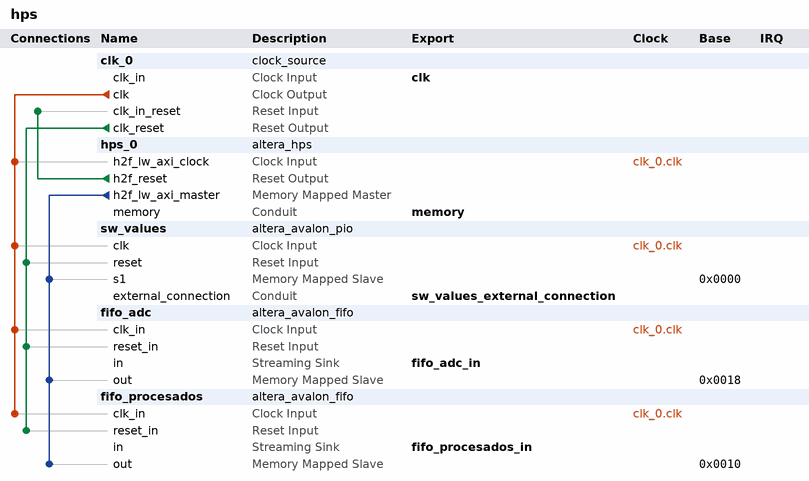
[diagram p0: system contents]
# Platform Designer (Qsys) system hps, Cyclone V 5CSEBA6U23I7
# Parameters at their usual value, and those the tool derives, are not listed.
package require -exact qsys 13.1
create_system hps
set_project_property DEVICE_FAMILY {Cyclone V}
set_project_property DEVICE 5CSEBA6U23I7

add_instance clk_0 clock_source 13.1
set_instance_parameter_value clk_0 clockFrequency 50000000

add_instance hps_0 altera_hps 13.1
set_instance_parameter_value hps_0 MEM_VENDOR JEDEC
set_instance_parameter_value hps_0 MEM_CLK_FREQ_MAX 400.0
set_instance_parameter_value hps_0 MEM_ROW_ADDR_WIDTH 12
set_instance_parameter_value hps_0 MEM_COL_ADDR_WIDTH 8
set_instance_parameter_value hps_0 MEM_DQ_WIDTH 8
set_instance_parameter_value hps_0 MEM_BANKADDR_WIDTH 3
set_instance_parameter_value hps_0 MEM_DRV_STR RZQ/6
set_instance_parameter_value hps_0 MEM_RTT_NOM {ODT Disabled}
set_instance_parameter_value hps_0 MEM_RTT_WR {Dynamic ODT off}
set_instance_parameter_value hps_0 MEM_WTCL 6
set_instance_parameter_value hps_0 MEM_TCL 7
set_instance_parameter_value hps_0 TIMING_TIS 175
set_instance_parameter_value hps_0 TIMING_TIH 250
set_instance_parameter_value hps_0 TIMING_TDS 50
set_instance_parameter_value hps_0 TIMING_TDH 125
set_instance_parameter_value hps_0 TIMING_TDQSQ 120
set_instance_parameter_value hps_0 TIMING_TDQSCK 400
set_instance_parameter_value hps_0 TIMING_TQSH 0.38
set_instance_parameter_value hps_0 MEM_TINIT_US 499
set_instance_parameter_value hps_0 MEM_TMRD_CK 3
set_instance_parameter_value hps_0 MEM_TRAS_NS 40.0
set_instance_parameter_value hps_0 MEM_TRCD_NS 15.0
set_instance_parameter_value hps_0 MEM_TRP_NS 15.0
set_instance_parameter_value hps_0 MEM_TREFI_US 7.0
set_instance_parameter_value hps_0 MEM_TRFC_NS 75.0
set_instance_parameter_value hps_0 MEM_TWTR 2
set_instance_parameter_value hps_0 MEM_TFAW_NS 37.5
set_instance_parameter_value hps_0 REF_CLK_FREQ 125.0
set_instance_parameter_value hps_0 DEFAULT_FAST_SIM_MODEL true
set_instance_parameter_value hps_0 TIMING_BOARD_MAX_CK_DELAY 0.6
set_instance_parameter_value hps_0 TIMING_BOARD_MAX_DQS_DELAY 0.6
set_instance_parameter_value hps_0 TIMING_BOARD_SKEW_CKDQS_DIMM_MIN -0.01
set_instance_parameter_value hps_0 TIMING_BOARD_SKEW_CKDQS_DIMM_MAX 0.01
set_instance_parameter_value hps_0 TIMING_BOARD_SKEW_WITHIN_DQS 0.02
set_instance_parameter_value hps_0 TIMING_BOARD_SKEW_BETWEEN_DQS 0.02
set_instance_parameter_value hps_0 TIMING_BOARD_DQ_TO_DQS_SKEW 0.0
set_instance_parameter_value hps_0 TIMING_BOARD_AC_SKEW 0.02
set_instance_parameter_value hps_0 TIMING_BOARD_AC_TO_CK_SKEW 0.0
set_instance_parameter_value hps_0 MEM_CLK_FREQ 300.0
set_instance_parameter_value hps_0 HPS_PROTOCOL DDR3
set_instance_parameter_value hps_0 STM_Enable false
set_instance_parameter_value hps_0 F2S_Width 0
set_instance_parameter_value hps_0 S2F_Width 0
set_instance_parameter_value hps_0 LWH2F_Enable true
set_instance_parameter_value hps_0 F2SCLK_DBGRST_Enable false
set_instance_parameter_value hps_0 F2SCLK_WARMRST_Enable false
set_instance_parameter_value hps_0 F2SCLK_COLDRST_Enable false
set_instance_parameter_value hps_0 F2SINTERRUPT_Enable false
set_instance_parameter_value hps_0 EMAC1_PinMuxing Unused
set_instance_parameter_value hps_0 EMAC1_Mode N/A
set_instance_parameter_value hps_0 QSPI_PinMuxing Unused
set_instance_parameter_value hps_0 QSPI_Mode N/A
set_instance_parameter_value hps_0 SDIO_PinMuxing Unused
set_instance_parameter_value hps_0 SDIO_Mode N/A
set_instance_parameter_value hps_0 USB1_PinMuxing Unused
set_instance_parameter_value hps_0 USB1_Mode N/A
set_instance_parameter_value hps_0 SPIM1_PinMuxing Unused
set_instance_parameter_value hps_0 SPIM1_Mode N/A
set_instance_parameter_value hps_0 UART0_PinMuxing Unused
set_instance_parameter_value hps_0 UART0_Mode N/A
set_instance_parameter_value hps_0 I2C0_PinMuxing Unused
set_instance_parameter_value hps_0 I2C0_Mode N/A
set_instance_parameter_value hps_0 I2C1_PinMuxing Unused
set_instance_parameter_value hps_0 I2C1_Mode N/A
set_instance_parameter_value hps_0 S2FCLK_USER1CLK_FREQ 100
set_instance_parameter_value hps_0 FPGA_PERIPHERAL_OUTPUT_CLOCK_FREQ_EMAC0_MD_CLK 100
set_instance_parameter_value hps_0 FPGA_PERIPHERAL_OUTPUT_CLOCK_FREQ_EMAC0_GTX_CLK 100
set_instance_parameter_value hps_0 FPGA_PERIPHERAL_OUTPUT_CLOCK_FREQ_EMAC1_MD_CLK 100
set_instance_parameter_value hps_0 FPGA_PERIPHERAL_OUTPUT_CLOCK_FREQ_EMAC1_GTX_CLK 100

add_instance sw_values altera_avalon_pio 13.1
set_instance_parameter_value sw_values direction Input
set_instance_parameter_value sw_values width 8

add_instance fifo_adc altera_avalon_fifo 13.1
set_instance_parameter_value fifo_adc bitsPerSymbol 32
set_instance_parameter_value fifo_adc channelWidth 0
set_instance_parameter_value fifo_adc errorWidth 0
set_instance_parameter_value fifo_adc fifoDepth 128
set_instance_parameter_value fifo_adc fifoInputInterfaceOptions AVALONST_SINK
set_instance_parameter_value fifo_adc fifoOutputInterfaceOptions AVALONMM_READ
set_instance_parameter_value fifo_adc singleClockMode true
set_instance_parameter_value fifo_adc symbolsPerBeat 1
set_instance_parameter_value fifo_adc useBackpressure false
set_instance_parameter_value fifo_adc useIRQ true
set_instance_parameter_value fifo_adc usePacket false
set_instance_parameter_value fifo_adc useReadControl false
set_instance_parameter_value fifo_adc useWriteControl false

add_instance fifo_procesados altera_avalon_fifo 13.1
set_instance_parameter_value fifo_procesados bitsPerSymbol 32
set_instance_parameter_value fifo_procesados channelWidth 0
set_instance_parameter_value fifo_procesados errorWidth 0
set_instance_parameter_value fifo_procesados fifoDepth 128
set_instance_parameter_value fifo_procesados fifoInputInterfaceOptions AVALONST_SINK
set_instance_parameter_value fifo_procesados fifoOutputInterfaceOptions AVALONMM_READ
set_instance_parameter_value fifo_procesados singleClockMode true
set_instance_parameter_value fifo_procesados symbolsPerBeat 1
set_instance_parameter_value fifo_procesados useBackpressure false
set_instance_parameter_value fifo_procesados useIRQ true
set_instance_parameter_value fifo_procesados usePacket false
set_instance_parameter_value fifo_procesados useReadControl false
set_instance_parameter_value fifo_procesados useWriteControl false

# connections
add_connection clk_0.clk fifo_adc.clk_in clock
add_connection clk_0.clk fifo_procesados.clk_in clock
add_connection clk_0.clk hps_0.h2f_lw_axi_clock clock
add_connection clk_0.clk sw_values.clk clock
add_connection clk_0.clk_reset fifo_adc.reset_in reset
add_connection clk_0.clk_reset fifo_procesados.reset_in reset
add_connection clk_0.clk_reset sw_values.reset reset
add_connection hps_0.h2f_reset clk_0.clk_in_reset reset
add_connection hps_0.h2f_lw_axi_master fifo_adc.out avalon
set_connection_parameter_value hps_0.h2f_lw_axi_master/fifo_adc.out baseAddress 0x0018
add_connection hps_0.h2f_lw_axi_master fifo_procesados.out avalon
set_connection_parameter_value hps_0.h2f_lw_axi_master/fifo_procesados.out baseAddress 0x0010
add_connection hps_0.h2f_lw_axi_master sw_values.s1 avalon
set_connection_parameter_value hps_0.h2f_lw_axi_master/sw_values.s1 baseAddress 0x0000

# exported interfaces
add_interface clk clock sink
set_interface_property clk EXPORT_OF clk_0.clk_in
add_interface memory conduit end
set_interface_property memory EXPORT_OF hps_0.memory
add_interface sw_values_external_connection conduit end
set_interface_property sw_values_external_connection EXPORT_OF sw_values.external_connection
add_interface fifo_adc_in avalon_streaming sink
set_interface_property fifo_adc_in EXPORT_OF fifo_adc.in
add_interface fifo_procesados_in avalon_streaming sink
set_interface_property fifo_procesados_in EXPORT_OF fifo_procesados.in

set_interconnect_requirement {$system} qsys_mm.clockCrossingAdapter HANDSHAKE
set_interconnect_requirement {$system} qsys_mm.maxAdditionalLatency 1
set_interconnect_requirement {$system} qsys_mm.insertDefaultSlave false

save_system hps.qsys
